# Altium schematic sheet Connector.SchDoc
size A3; Author: ALP Electronics; CompanyName: ALP Electronics; DrawnBy: Caner Alp; Engineer: Caner Alp; Organization: ALP Electronics; Address2: Västerås; Address4: Sweden; SheetNumber: 11; SheetTotal: 14
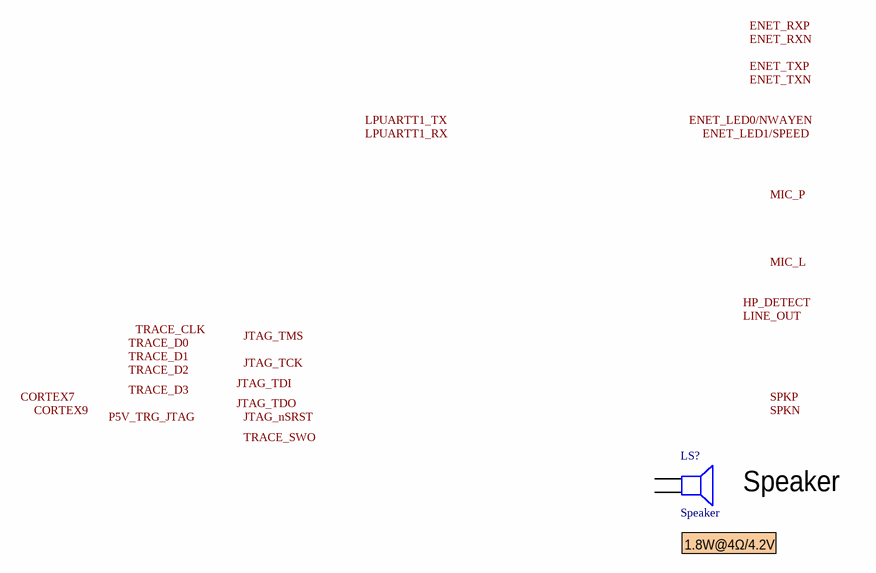
[diagram p0: Connector.SchDoc]

## Parts
LS?  Speaker  [JST XH B2B-XH-A]

## Nets

Not connected (* = marked no-connect by the designer): LS? 1 2

## Notes on the sheet
- Speaker
- (near LS?) 1.8W@4Ω/4.2V
- Labels drawn without touching a wire or pin: CORTEX7, CORTEX9, ENET_LED0/NWAYEN, ENET_LED1/SPEED, ENET_RXN, ENET_RXP, ENET_TXN, ENET_TXP, HP_DETECT, JTAG_nSRST, JTAG_TCK, JTAG_TDI, JTAG_TDO, JTAG_TMS, LINE_OUT, LPUARTT1_RX, LPUARTT1_TX, MIC_L, MIC_P, P5V_TRG_JTAG, SPKN, SPKP, TRACE_CLK, TRACE_D0, TRACE_D1, TRACE_D2, TRACE_D3, TRACE_SWO
- Title:
- Size:
- Project:
- A3
- Date:
- Revision:
- Drawn By:
- Sheet
- of

## Library data of the parts
LS? = Speaker: Loudspeaker; Published: 24-Mar-1999; LatestRevisionDate: 17-Jul-2002; LatestRevisionNote: Re-released for DXP Platform.; PackageReference: PIN2; Publisher: Altium Limited